# Altium schematic sheet Hall_Sensor_cct.SchDoc
size A4
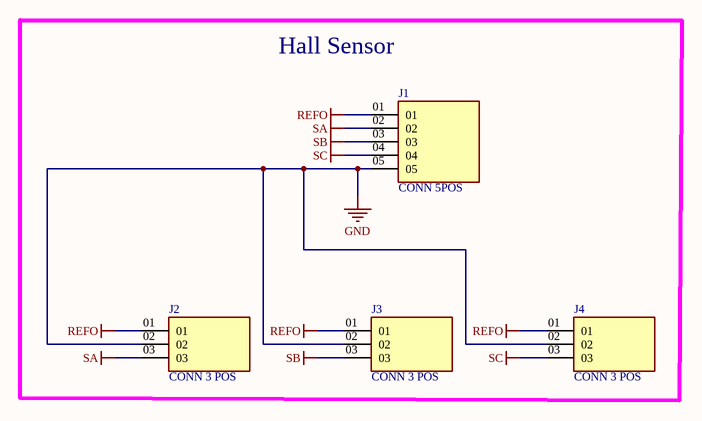
[diagram p0: Hall_Sensor_cct.SchDoc]

## Parts
J1  CONN 5POS  [SAMTEC_SSQ-105-23-G-S]
J2  CONN 3 POS  [SAMTEC_SSQ-103-04-G-S]
J3  CONN 3 POS  [SAMTEC_SSQ-103-04-G-S]
J4  CONN 3 POS  [SAMTEC_SSQ-103-04-G-S]

## Blocks framed on the sheet
Hall Sensor: J1-J4

## Nets
GND: J1.05 J2.02 J3.02 J4.02
REFO: J1.01 J2.01 J3.01 J4.01
SA: J1.02 J2.03
SB: J1.03 J3.03
SC: J1.04 J4.03

## Library data of the parts
J1 = CONN 5POS: CONN RCPT 5POS 0.1 GOLD PCB; MF: Samtec; MP: SSQ-105-23-G-S; Package: None; Value: *; Price: None; Check_prices: https://www.snapeda.com/parts/SSQ-105-23-G-S/Samtec/view-part/3262872/?ref=eda; Purchase-URL: https://pricing.snapeda.com/search/part/SSQ-105-23-G-S/?ref=eda; Availability: In Stock; SnapEDA_Link: https://www.snapeda.com/parts/SSQ-105-23-G-S/Samtec/view-part/3262872/?ref=snap
J2-J4 = CONN 3 POS: CONN RCPT 3POS 0.1 GOLD PCB; MF: Samtec; MP: SSQ-103-04-G-S; Check_prices: https://www.snapeda.com/parts/SSQ-103-04-G-S/Samtec/view-part/3382037/?ref=eda; Purchase-URL: https://pricing.snapeda.com/search/part/SSQ-103-04-G-S/?ref=eda; Price: None; Availability: In Stock; Value: *; SnapEDA_Link: https://www.snapeda.com/parts/SSQ-103-04-G-S/Samtec/view-part/3382037/?ref=snap; Package: None